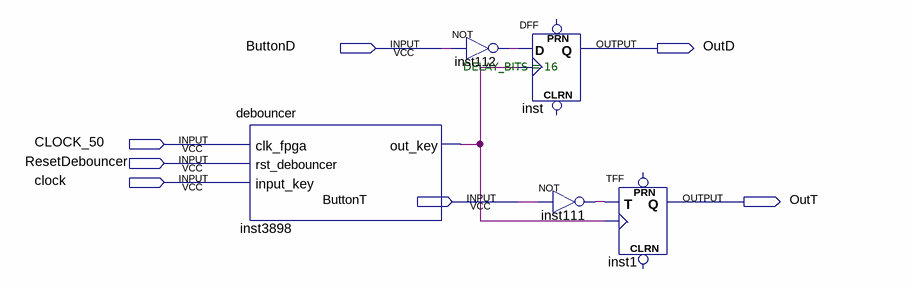
[diagram p0: schematic sheet]
// Quartus schematic FF.bdf as structural Verilog: 5 symbols, 7 pins
module FF (
  input  ButtonD,
  input  CLOCK_50,
  input  ResetDebouncer,
  input  clock,
  input  ButtonT,
  output OutD,
  output OutT
);

  wire inst111_out, inst112_out, inst3898_out_key;

  debouncer #(.DELAY_BITS(16)) inst3898 (
    .clk_fpga(CLOCK_50), .rst_debouncer(ResetDebouncer), .input_key(clock), .out_key(inst3898_out_key));
  not inst112 (inst112_out, ButtonD);
  DFF inst (.CLK(inst3898_out_key), .D(inst112_out), .Q(OutD));  // open: CLRN, PRN
  not inst111 (inst111_out, ButtonT);
  TFF inst1 (.T(inst111_out), .CLK(inst3898_out_key), .Q(OutT));  // open: PRN, CLRN
endmodule
